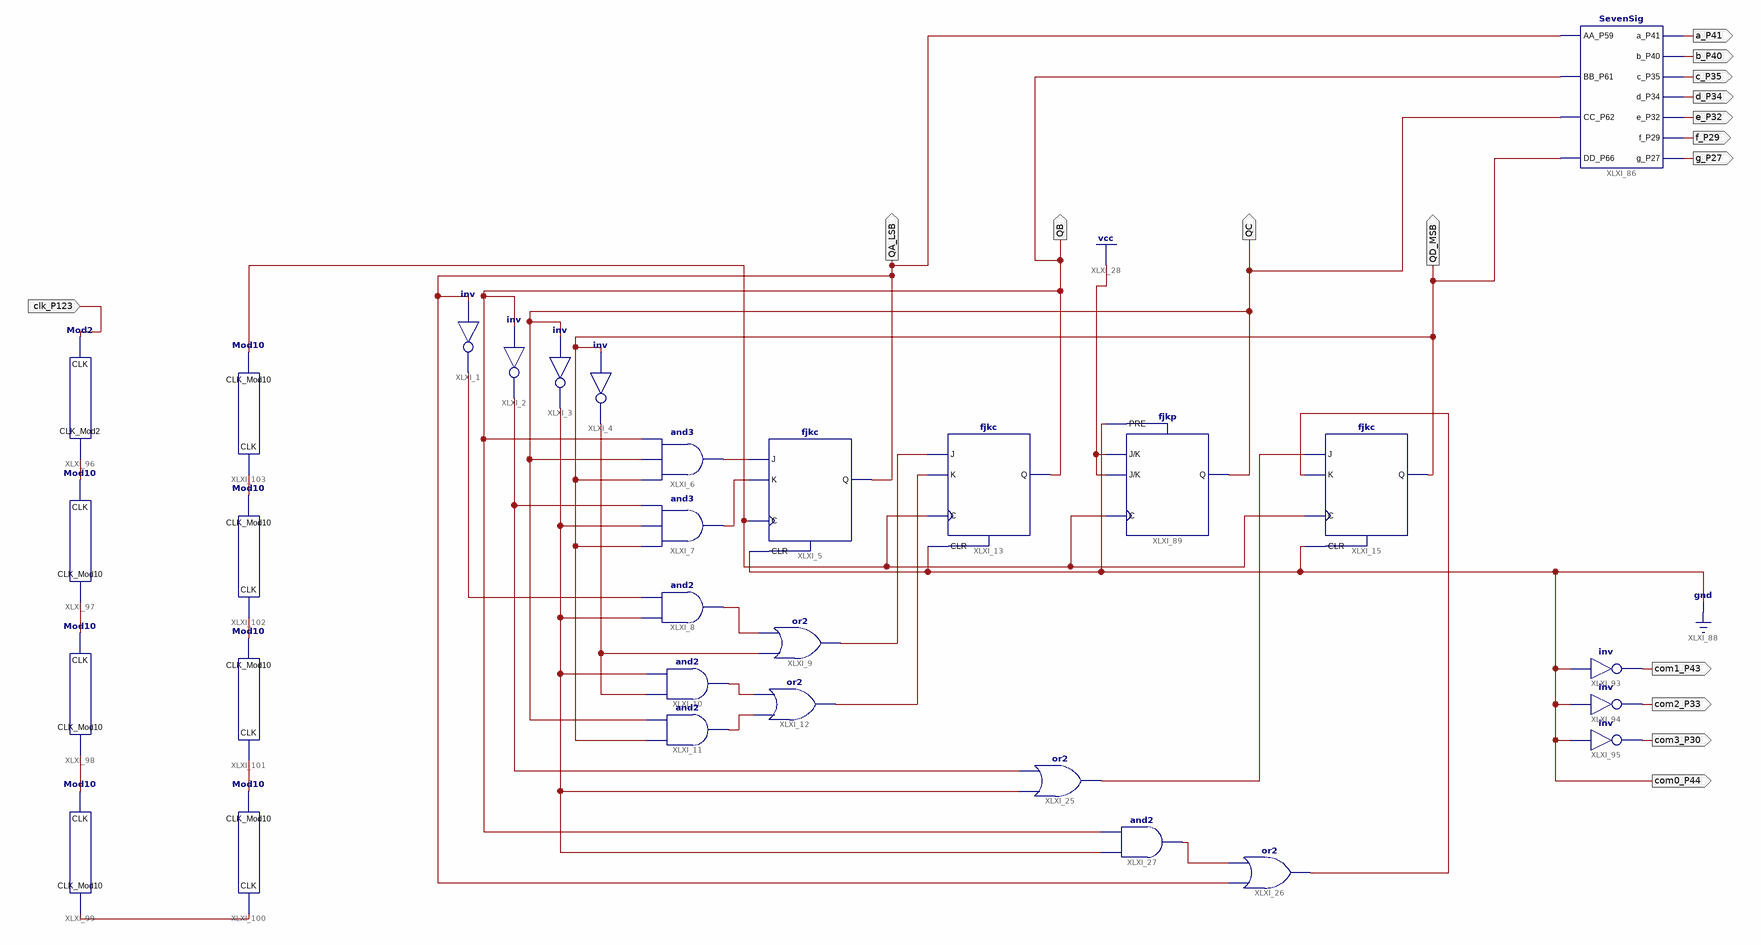
[diagram p0: schematic sheet 1]
// Xilinx ISE schematic Lab8_2counter2.sch (spartan6) as structural Verilog: 30 symbols, 16 ports
module Lab8_2counter2 (
  input  clk_P123,
  output a_P41,
  output b_P40,
  output c_P35,
  output d_P34,
  output e_P32,
  output f_P29,
  output g_P27,
  output QC,
  output QB,
  output QA_LSB,
  output QD_MSB,
  output com0_P44,
  output com1_P43,
  output com2_P33,
  output com3_P30
);

  wire QAinv, QBinv, QCinv, QDinv, XLXN_3, XLXN_5, XLXN_6, XLXN_8, XLXN_9, XLXN_11, XLXN_13, XLXN_14,
       XLXN_15, XLXN_52, XLXN_167, XLXN_168, XLXN_169, XLXN_170, XLXN_171, XLXN_172, XLXN_173, XLXN_175;

  not XLXI_1 (QAinv, QA_LSB);
  not XLXI_2 (QBinv, QB);
  not XLXI_3 (QCinv, QC);
  not XLXI_4 (QDinv, QD_MSB);
  fjkc XLXI_5 (.C(XLXN_175), .CLR(1'b0), .J(XLXN_3), .K(XLXN_52), .Q(QA_LSB));
  and XLXI_6 (XLXN_3, QD_MSB, QC, QB);
  and XLXI_7 (XLXN_52, QD_MSB, QCinv, QBinv);
  and XLXI_8 (XLXN_5, QCinv, QAinv);
  or XLXI_9 (XLXN_6, QDinv, XLXN_5);
  and XLXI_10 (XLXN_8, QDinv, QCinv);
  and XLXI_11 (XLXN_9, QD_MSB, QC);
  or XLXI_12 (XLXN_11, XLXN_9, XLXN_8);
  fjkc XLXI_13 (.C(XLXN_175), .CLR(1'b0), .J(XLXN_6), .K(XLXN_11), .Q(QB));
  or XLXI_25 (XLXN_13, QCinv, QBinv);
  fjkc XLXI_15 (.C(XLXN_175), .CLR(1'b0), .J(XLXN_13), .K(XLXN_14), .Q(QD_MSB));
  and XLXI_27 (XLXN_15, QCinv, QB);
  or XLXI_26 (XLXN_14, QA_LSB, XLXN_15);
  SevenSig XLXI_86 (
    .AA_P59(QA_LSB), .BB_P61(QB), .CC_P62(QC), .DD_P66(QD_MSB), .a_P41(a_P41), .b_P40(b_P40), .c_P35(c_P35),
    .d_P34(d_P34), .e_P32(e_P32), .f_P29(f_P29), .g_P27(g_P27));
  fjkp XLXI_89 (.C(XLXN_175), .J(1'b1), .K(1'b1), .PRE(1'b0), .Q(QC));
  not XLXI_93 (com1_P43, 1'b0);
  not XLXI_94 (com2_P33, 1'b0);
  not XLXI_95 (com3_P30, 1'b0);
  Mod2 XLXI_96 (.CLK(clk_P123), .CLK_Mod2(XLXN_167));
  Mod10 XLXI_97 (.CLK(XLXN_167), .CLK_Mod10(XLXN_168));
  Mod10 XLXI_98 (.CLK(XLXN_168), .CLK_Mod10(XLXN_169));
  Mod10 XLXI_99 (.CLK(XLXN_169), .CLK_Mod10(XLXN_170));
  Mod10 XLXI_100 (.CLK(XLXN_170), .CLK_Mod10(XLXN_171));
  Mod10 XLXI_101 (.CLK(XLXN_171), .CLK_Mod10(XLXN_172));
  Mod10 XLXI_102 (.CLK(XLXN_172), .CLK_Mod10(XLXN_173));
  Mod10 XLXI_103 (.CLK(XLXN_173), .CLK_Mod10(XLXN_175));

  assign com0_P44 = 1'b0;
endmodule
